# EAGLE design controller_rev3.1 (EAGLE 9.0.1)

## Sheet 1 of 3: Controller
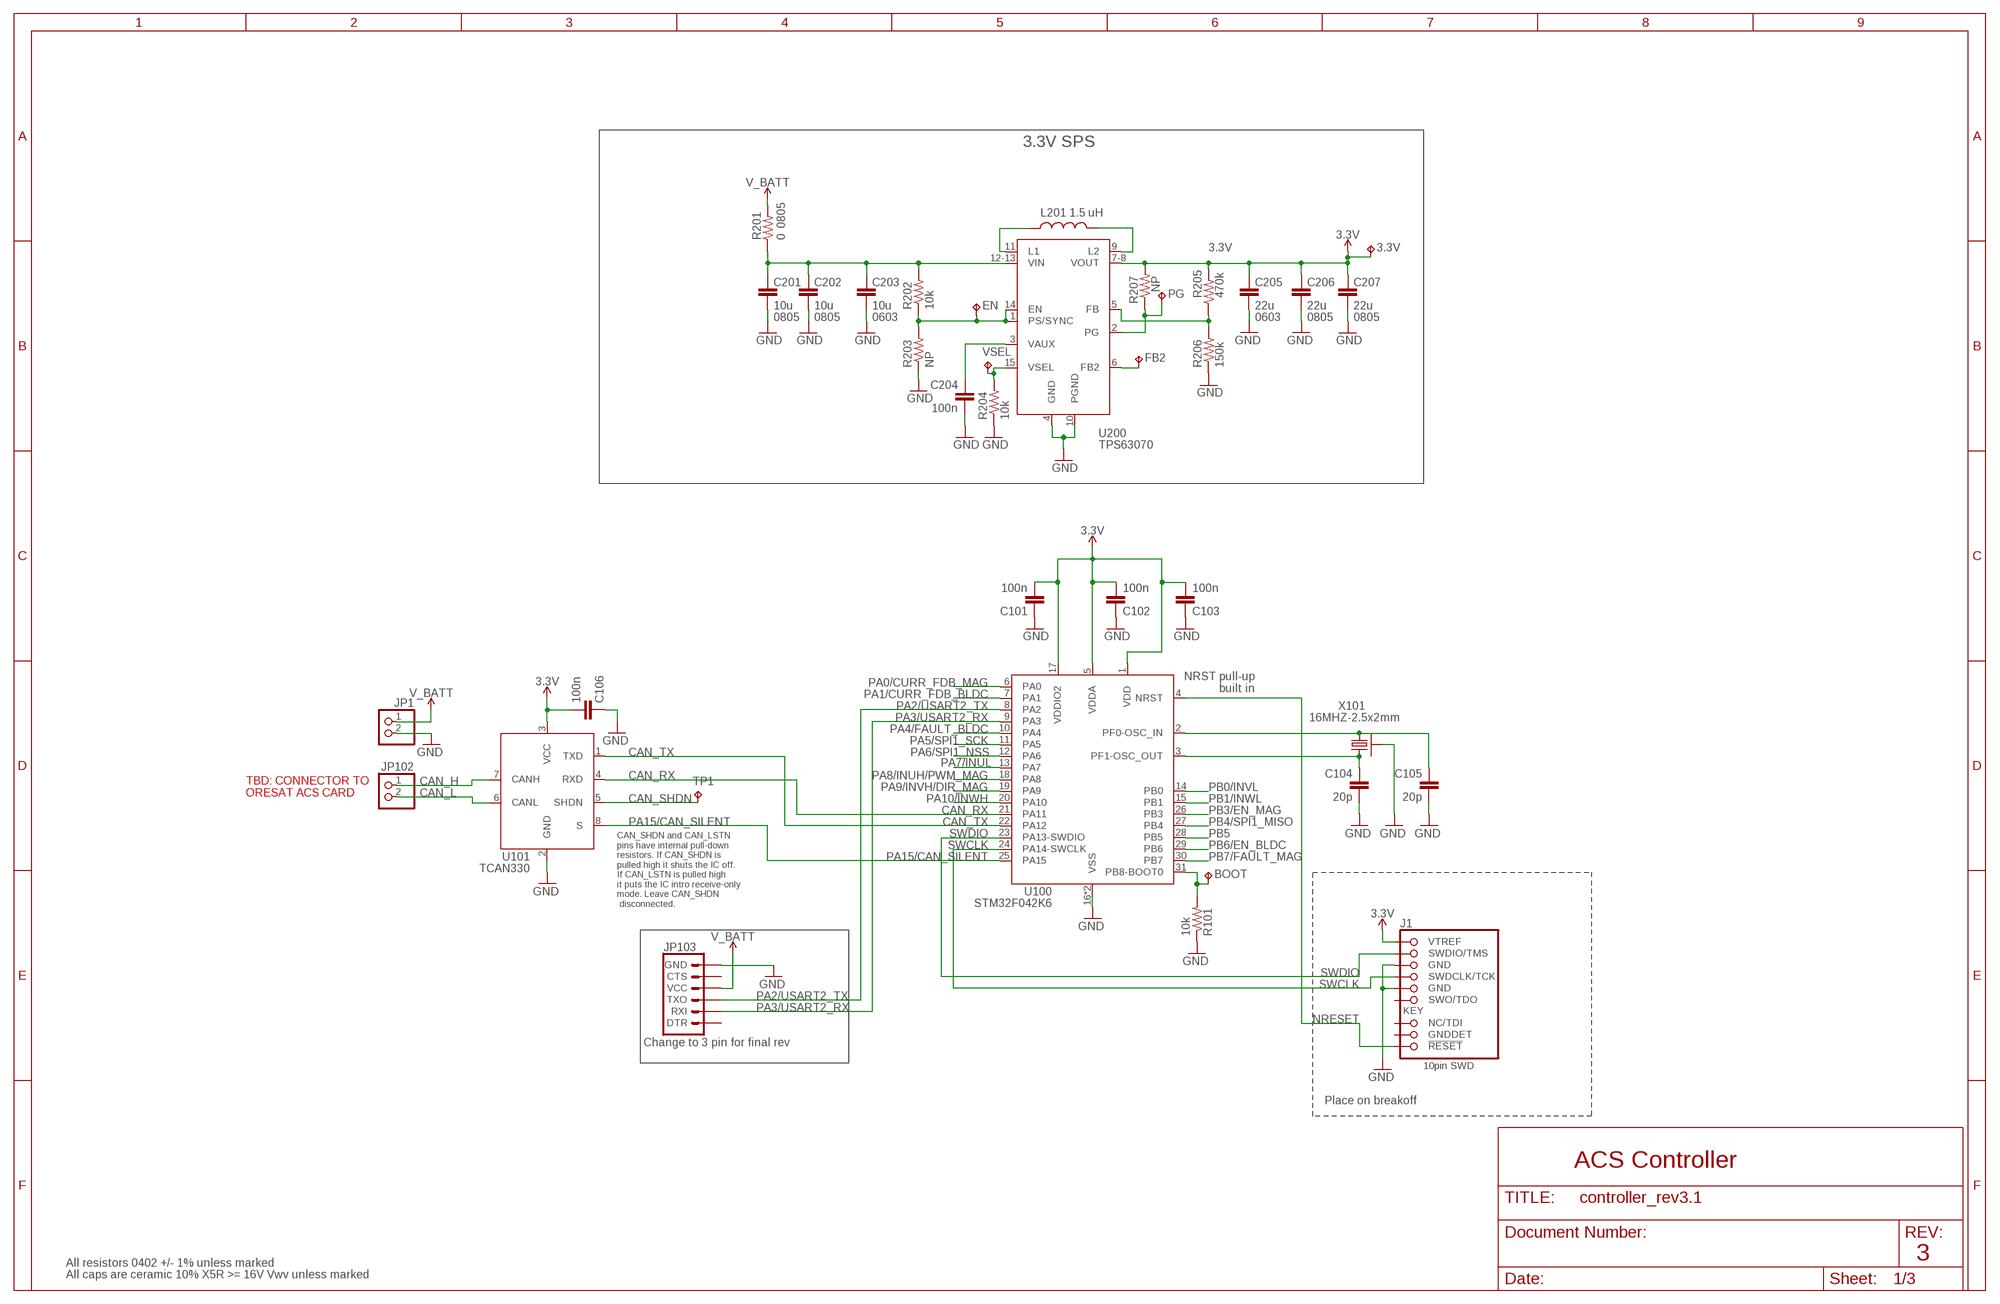
[diagram p0: schematic, sheet 1]

### Parts
3.3V  TPTP15SQ  [TP15SQ]
BOOT  TPTP15SQ  [TP15SQ]
C101  100n  C-EU0402-B-NOSILK  [.0402-B-NOSILK]
C102  100n  C-EU0402-B-NOSILK  [.0402-B-NOSILK]
C103  100n  C-EU0402-B-NOSILK  [.0402-B-NOSILK]
C104  20p  C-EU0402-B-NOSILK  [.0402-B-NOSILK]
C105  20p  C-EU0402-B-NOSILK  [.0402-B-NOSILK]
C106  100n  C-EU0402-B-NOSILK  [.0402-B-NOSILK]
C201  10u  C-EU0805-B-NOSILK  [.0805-B-NOSILK]
C202  10u  C-EU0805-B-NOSILK  [.0805-B-NOSILK]
C203  10u  C-EU0603-B-NOSILK  [.0603-B-NOSILK]
C204  100n  C-EU0402-B-NOSILK  [.0402-B-NOSILK]
C205  22u  C-EU0603-B-NOSILK  [.0603-B-NOSILK]
C206  22u  C-EU0805-B-NOSILK  [.0805-B-NOSILK]
C207  22u  C-EU0805-B-NOSILK  [.0805-B-NOSILK]
EN  TPTP15SQ  [TP15SQ]
FB2  TPTP15SQ  [TP15SQ]
J1  1.27MM-SWD-CONNECTOR  [1.27MM_2X5]
JP1  PINHD-1X2  [1X02]
JP102  PINHD-1X2  [1X02]
JP103  6_PIN_SERIAL_TARGETSILK  [6_PIN_SERIAL_TARGET_SIDE_W_SILK]
L201  1.5 uH  L-COILCRAFT-XFL4020  [L-COILCRAFT-XFL4020]
PG  TPTP15SQ  [TP15SQ]
R101  10k  R-US_0402-B-NOSILK  [.0402-B-NOSILK]
R201  0  R-US_0805-B-NOSILK  [.0805-B-NOSILK]
R202  10k  R-US_0402-B-NOSILK  [.0402-B-NOSILK]
R203  NP  R-US_0402-B-NOSILK  [.0402-B-NOSILK]
R204  10k  R-US_0402-B-NOSILK  [.0402-B-NOSILK]
R205  470k  R-US_0402-B-NOSILK  [.0402-B-NOSILK]
R206  150k  R-US_0402-B-NOSILK  [.0402-B-NOSILK]
R207  NP  R-US_0402-B-NOSILK  [.0402-B-NOSILK]
TP1  TPTP06R  [TP06R]
U100  STM32F042K6  [QFP32-7X7]
U101  TCAN330  [SOT23-8_TI-DCN]
U200  TPS63070  TPS63070X  [TPS63070X]
VSEL  TPTP15SQ  [TP15SQ]
X101  16MHZ-2.5x2mm  CRYSTAL-WITH-GND  [CRYSTAL_2.5X2]

### Nets
3.3V: 3.3V.TP C101.2 C102.2 C103.2 C106.2 C205.1 C206.1 C207.1 J1.VTREF R205.2 R207.2 U100.1(VDD) U100.5(VDDA) U100.17(VDDIO2) U101.3(VCC) U200.7-8(VOUT) ; also sheet 2,3
BOOT: BOOT.TP R101.2 U100.31(PB8-BOOT0)
CAN_H: JP102.1 U101.7(CANH)
CAN_L: JP102.2 U101.6(CANL)
CAN_RX: U100.21(PA11) U101.4(RXD)
CAN_SHDN: TP1.TP U101.5(SHDN)
CAN_TX: U100.22(PA12) U101.1(TXD)
CRYSTALIN: C105.1 U100.2(PF0-OSC_IN) X101.1
CRYSTALOUT: C104.1 U100.3(PF1-OSC_OUT) X101.3
GND: C101.1 C102.1 C103.1 C104.2 C105.2 C106.1 C201.2 C202.2 C203.2 C204.2 C205.2 C206.2 C207.2 J1.GND J1.GND@2(GND) JP1.2 JP103.P$6(GND) R101.1 R203.1 R204.1 R206.1 U100.16(VSS) U100.32(VSS) U101.2(GND) U200.4(GND) U200.10(PGND) X101.2(SHIELD) X101.4(SHIELD) ; also sheet 2,3
NRESET: J1.!RESET U100.4(NRST)
PA0/CURR_FDB_MAG: U100.6(PA0) ; also sheet 3
PA1/CURR_FDB_BLDC: U100.7(PA1) ; also sheet 2
PA2/USART2_TX: JP103.P$2(TXO) U100.8(PA2)
PA3/USART2_RX: JP103.P$3(RXI) U100.9(PA3)
PA4/FAULT_BLDC: U100.10(PA4) ; also sheet 2
PA5/SPI1_SCK: U100.11(PA5) ; also sheet 2
PA6/SPI1_NSS: U100.12(PA6) ; also sheet 2
PA7/INUL: U100.13(PA7) ; also sheet 2
PA8/INUH/PWM_MAG: U100.18(PA8) ; also sheet 2,3
PA9/INVH/DIR_MAG: U100.19(PA9) ; also sheet 2,3
PA10/INWH: U100.20(PA10) ; also sheet 2
PA15/CAN_SILENT: U100.25(PA15) U101.8(S)
PB0/INVL: U100.14(PB0) ; also sheet 2
PB1/INWL: U100.15(PB1) ; also sheet 2
PB3/EN_MAG: U100.26(PB3) ; also sheet 3
PB4/SPI1_MISO: U100.27(PB4) ; also sheet 2
PB5: U100.28(PB5)
PB6/EN_BLDC: U100.29(PB6) ; also sheet 2
PB7/FAULT_MAG: U100.30(PB7) ; also sheet 3
SWCLK: J1.SWDCLK(SWDCLK/TCK) U100.24(PA14-SWCLK)
SWDIO: J1.SWDIO(SWDIO/TMS) U100.23(PA13-SWDIO)
TPS-EN: EN.TP R202.1 R203.2 U200.1(PS/SYNC) U200.14(EN)
TPS-FB: R205.1 R206.2 U200.5(FB)
TPS-L1: L201.1 U200.11(L1)
TPS-L2: L201.2 U200.9(L2)
TPS-PG: PG.TP R207.1 U200.2(PG)
TPS-VAUX: C204.1 U200.3(VAUX)
TPS-VIN: C201.1 C202.1 C203.1 R201.1 R202.2 U200.12-13(VIN)
TSP-FB2: FB2.TP U200.6(FB2)
TSP-VSEL: R204.2 U200.15(VSEL) VSEL.TP
V_BATT: JP1.1 JP103.P$4(VCC) R201.2 ; also sheet 2,3
Unconnected: J1.GNDDET J1.NC(NC/TDI) J1.SWO(SWO/TDO) JP103.P$1(DTR) JP103.P$5(CTS)

### Notes on the sheet
- 3.3V SPS
- 0805
- 0805 | 0805 | 0603 | 0603 | 0805 | 0805
- NRST pull-up
  built in
- TBD: CONNECTOR TO 
  ORESAT ACS CARD
- CAN_SHDN and CAN_LSTN
  pins have internal pull-down
  resistors. If CAN_SHDN is 
  pulled high it shuts the IC off.
  If CAN_LSTN is pulled high
  it puts the IC intro receive-only
  mode. Leave CAN_SHDN
   disconnected.
- Change to 3 pin for final rev
- Place on breakoff
- ACS Controller
- 3
- All resistors 0402 +/- 1% unless marked
- All caps are ceramic 10% X5R >= 16V Vwv unless marked

## Sheet 2 of 3: Reaction Wheel
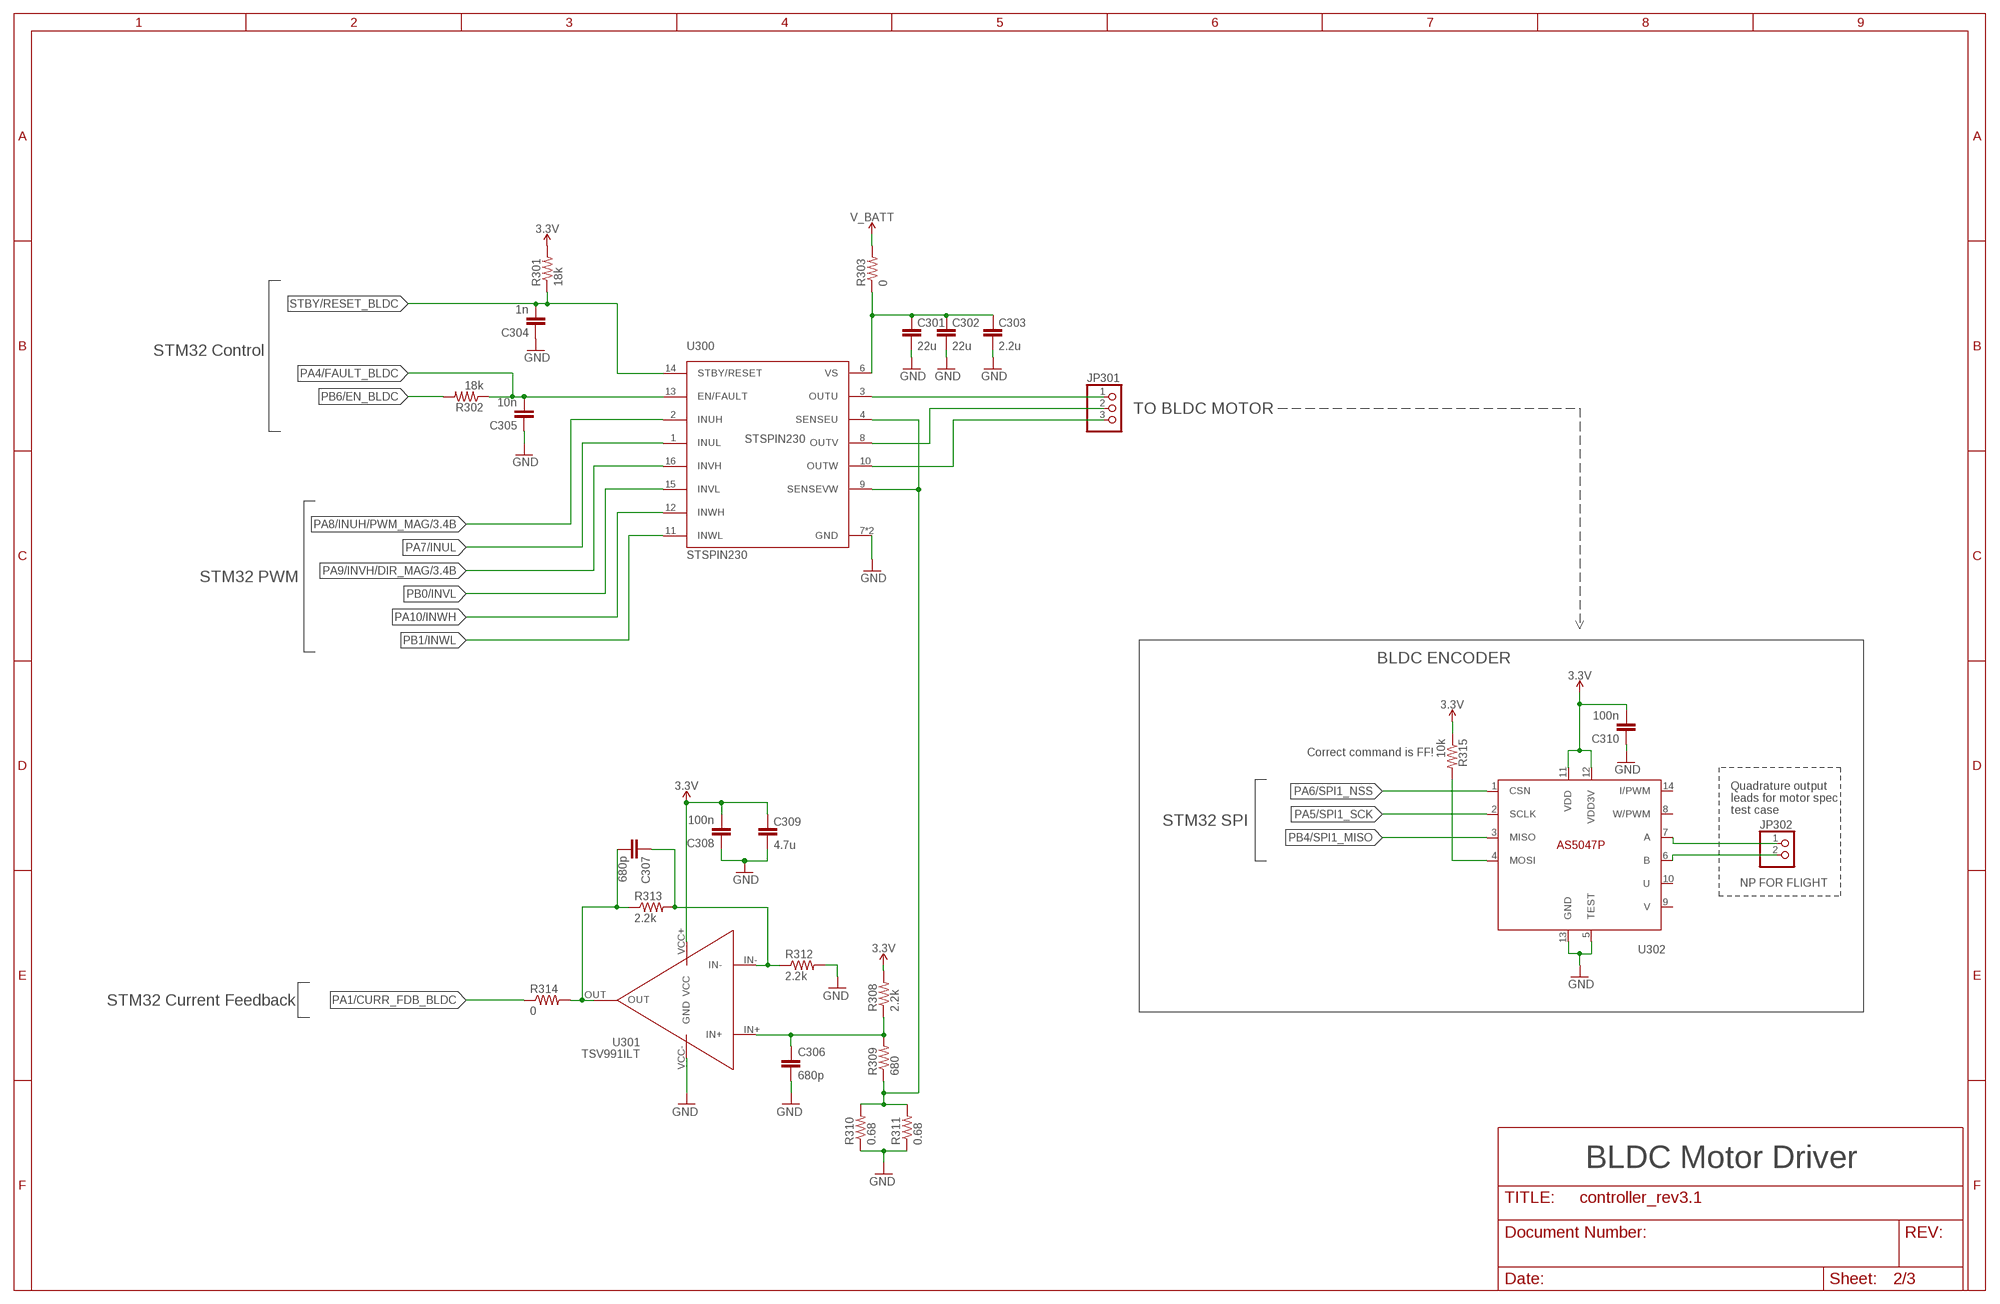
[diagram p1: schematic, sheet 2]

### Parts
C301  22u  C-EU0603-B-NOSILK  [.0603-B-NOSILK]
C302  22u  C-EU0603-B-NOSILK  [.0603-B-NOSILK]
C303  2.2u  C-EU0603-B-NOSILK  [.0603-B-NOSILK]
C304  1n  C-EU0402-B-NOSILK  [.0402-B-NOSILK]
C305  10n  C-EU0402-B-NOSILK  [.0402-B-NOSILK]
C306  680p  C-EU0402-B-NOSILK  [.0402-B-NOSILK]
C307  680p  C-EU0402-B-NOSILK  [.0402-B-NOSILK]
C308  100n  C-EU0402-B-NOSILK  [.0402-B-NOSILK]
C309  4.7u  C-EU0603-B-NOSILK  [.0603-B-NOSILK]
C310  100n  C-EU0402-B-NOSILK  [.0402-B-NOSILK]
JP301  PINHD-1X03_2.00  [1X03M]
JP302  PINHD-1X2  [1X02]
R301  18k  R-US_0402-B-NOSILK  [.0402-B-NOSILK]
R302  18k  R-US_0402-B-NOSILK  [.0402-B-NOSILK]
R303  0  R-US_0805-B-NOSILK  [.0805-B-NOSILK]
R308  2.2k  R-US_0402-B-NOSILK  [.0402-B-NOSILK]
R309  680  R-US_0402-B-NOSILK  [.0402-B-NOSILK]
R310  0.68  R-US_0805-B-NOSILK  [.0805-B-NOSILK]
R311  0.68  R-US_0805-B-NOSILK  [.0805-B-NOSILK]
R312  2.2k  R-US_0402-B-NOSILK  [.0402-B-NOSILK]
R313  2.2k  R-US_0402-B-NOSILK  [.0402-B-NOSILK]
R314  0  R-US_0402-B-NOSILK  [.0402-B-NOSILK]
R315  10k  R-US_0402-B-NOSILK  [.0402-B-NOSILK]
U300  STSPIN230  [VFQFPN]
U301  TSV991ILT  [SOT23-5]
U302  AS5047P  [TSSOP14]

### Nets
3.3V: C308.2 C309.1 C310.2 R301.2 R308.2 R315.1 U301.VCC+(VCC) U302.11(VDD) U302.12(VDD3V) ; also sheet 1,3
AS5047_MOSI: R315.2 U302.4(MOSI)
BLDC-I-IN+: C306.1 R308.1 R309.2 U301.IN+
BLDC-I-IN-: C307.1 R312.1 R313.2 U301.IN-
BLDC-I-OUT: C307.2 R313.1 R314.2 U301.OUT
GND: C301.2 C302.2 C303.2 C304.1 C305.1 C306.2 C308.1 C309.2 C310.1 R310.1 R311.1 R312.2 U300.7(GND) U300.EPAD(GND) U301.VCC-(GND) U302.5(TEST) U302.13(GND) ; also sheet 1,3
N$7: C301.1 C302.1 C303.1 R303.1 U300.6(VS)
PA1/CURR_FDB_BLDC: R314.1 ; also sheet 1
PA4/FAULT_BLDC: C305.2 R302.1 U300.13(EN/FAULT) ; also sheet 1
PA5/SPI1_SCK: U302.2(SCLK) ; also sheet 1
PA6/SPI1_NSS: U302.1(CSN) ; also sheet 1
PA7/INUL: U300.1(INUL) ; also sheet 1
PA8/INUH/PWM_MAG: U300.2(INUH) ; also sheet 1,3
PA9/INVH/DIR_MAG: U300.16(INVH) ; also sheet 1,3
PA10/INWH: U300.12(INWH) ; also sheet 1
PB0/INVL: U300.15(INVL) ; also sheet 1
PB1/INWL: U300.11(INWL) ; also sheet 1
PB4/SPI1_MISO: U302.3(MISO) ; also sheet 1
PB6/EN_BLDC: R302.2 ; also sheet 1
QUAD_A: JP302.1 U302.7(A)
QUAD_B: JP302.2 U302.6(B)
SENSE_BLDC: R309.1 R310.2 R311.2 U300.4(SENSEU) U300.9(SENSEVW)
STBY/RESET_BLDC: C304.2 R301.1 U300.14(STBY/RESET)
U: JP301.1 U300.3(OUTU)
V: JP301.2 U300.8(OUTV)
V_BATT: R303.2 ; also sheet 1,3
W: JP301.3 U300.10(OUTW)
Unconnected: U302.8(W/PWM) U302.9(V) U302.10(U) U302.14(I/PWM)

### Notes on the sheet
- STM32 Control
- TO BLDC MOTOR
- STM32 PWM
- BLDC ENCODER
- Correct command is FF!
- Quadrature output
  leads for motor spec
  test case
- STM32 SPI
- NP FOR FLIGHT
- STM32 Current Feedback
- BLDC Motor Driver

## Sheet 3 of 3: Magnetorquer
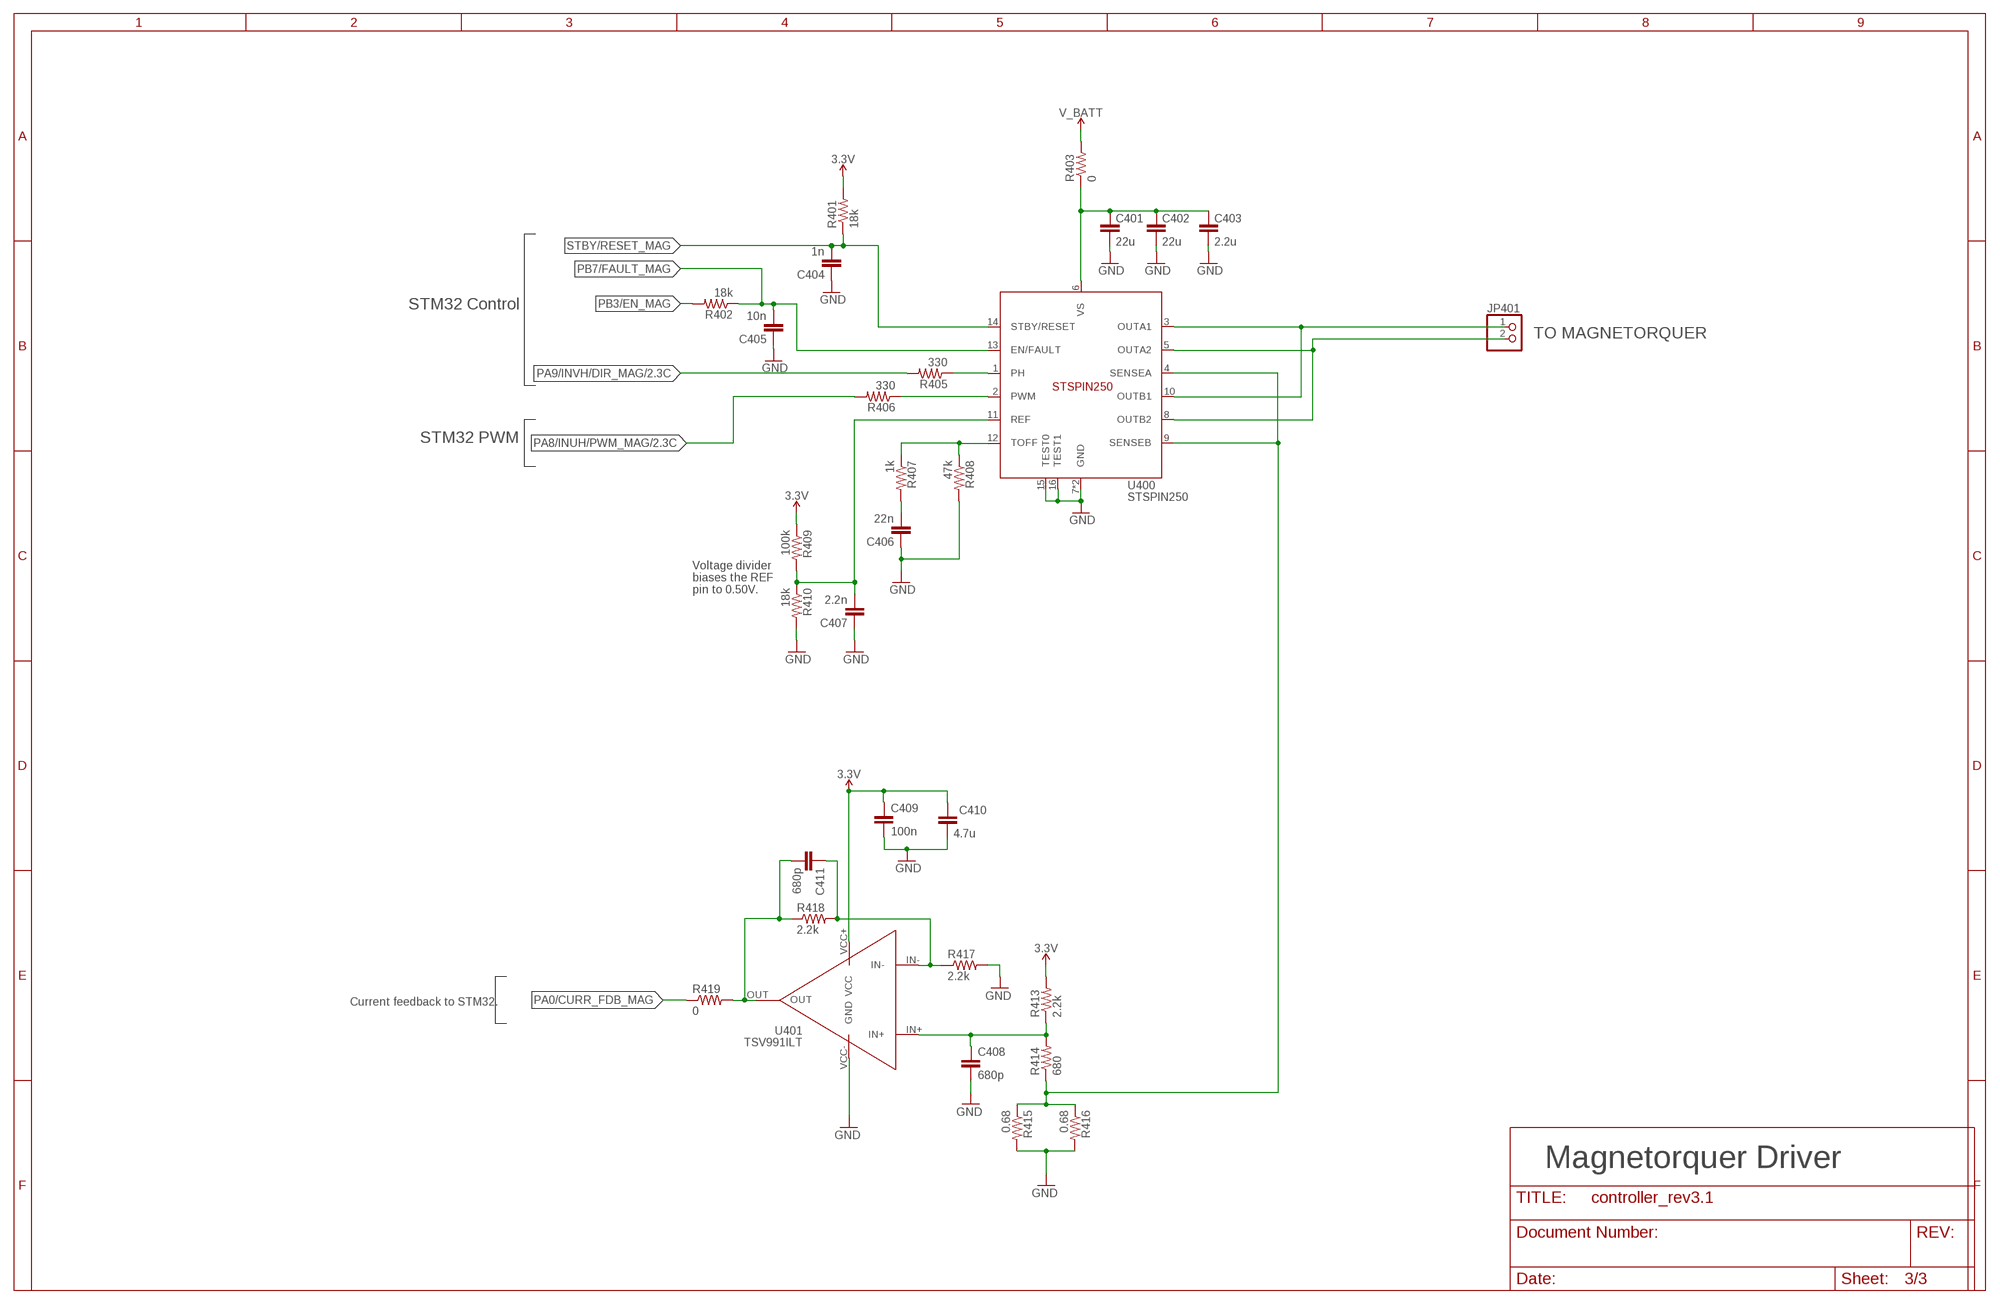
[diagram p2: schematic, sheet 3]

### Parts
C401  22u  C-EU0603-B-NOSILK  [.0603-B-NOSILK]
C402  22u  C-EU0603-B-NOSILK  [.0603-B-NOSILK]
C403  2.2u  C-EU0603-B-NOSILK  [.0603-B-NOSILK]
C404  1n  C-EU0402-B-NOSILK  [.0402-B-NOSILK]
C405  10n  C-EU0402-B-NOSILK  [.0402-B-NOSILK]
C406  22n  C-EU0402-B-NOSILK  [.0402-B-NOSILK]
C407  2.2n  C-EU0402-B-NOSILK  [.0402-B-NOSILK]
C408  680p  C-EU0402-B-NOSILK  [.0402-B-NOSILK]
C409  100n  C-EU0402-B-NOSILK  [.0402-B-NOSILK]
C410  4.7u  C-EU0603-B-NOSILK  [.0603-B-NOSILK]
C411  680p  C-EU0402-B-NOSILK  [.0402-B-NOSILK]
JP401  PINHD-1X2  [1X02]
R401  18k  R-US_0402-B-NOSILK  [.0402-B-NOSILK]
R402  18k  R-US_0402-B-NOSILK  [.0402-B-NOSILK]
R403  0  R-US_0805-B-NOSILK  [.0805-B-NOSILK]
R405  330  R-US_0402-B-NOSILK  [.0402-B-NOSILK]
R406  330  R-US_0402-B-NOSILK  [.0402-B-NOSILK]
R407  1k  R-US_0402-B-NOSILK  [.0402-B-NOSILK]
R408  47k  R-US_0402-B-NOSILK  [.0402-B-NOSILK]
R409  100k  R-US_0402-B-NOSILK  [.0402-B-NOSILK]
R410  18k  R-US_0402-B-NOSILK  [.0402-B-NOSILK]
R413  2.2k  R-US_0402-B-NOSILK  [.0402-B-NOSILK]
R414  680  R-US_0402-B-NOSILK  [.0402-B-NOSILK]
R415  0.68  R-US_0805-B-NOSILK  [.0805-B-NOSILK]
R416  0.68  R-US_0805-B-NOSILK  [.0805-B-NOSILK]
R417  2.2k  R-US_0402-B-NOSILK  [.0402-B-NOSILK]
R418  2.2k  R-US_0402-B-NOSILK  [.0402-B-NOSILK]
R419  0  R-US_0402-B-NOSILK  [.0402-B-NOSILK]
U400  STSPIN250  [VFQPN]
U401  TSV991ILT  [SOT23-5]

### Nets
3.3V: C409.1 C410.1 R401.2 R409.1 R413.2 U401.VCC+(VCC) ; also sheet 1,2
250_REF: C407.2 R409.2 R410.1 U400.11(REF)
250_TOFF: R407.1 R408.1 U400.12(TOFF)
GND: C401.2 C402.2 C403.2 C404.1 C405.1 C406.1 C407.1 C408.2 C409.2 C410.2 R408.2 R410.2 R415.2 R416.2 R417.2 U400.7(GND) U400.15(TEST0) U400.16(TEST1) U400.EPAD(GND) U401.VCC-(GND) ; also sheet 1,2
MAG-I-IN+: C408.1 R413.1 R414.2 U401.IN+
MAG-I-IN-: C411.1 R417.1 R418.2 U401.IN-
MAG-I-OUT: C411.2 R418.1 R419.2 U401.OUT
N$2: C406.2 R407.2
N$3: R406.1 U400.2(PWM)
N$5: R405.1 U400.1(PH)
N$8: C401.1 C402.1 C403.1 R403.1 U400.6(VS)
OUT1: JP401.1 U400.3(OUTA1) U400.10(OUTB1)
OUT2: JP401.2 U400.5(OUTA2) U400.8(OUTB2)
PA0/CURR_FDB_MAG: R419.1 ; also sheet 1
PA8/INUH/PWM_MAG: R406.2 ; also sheet 1,2
PA9/INVH/DIR_MAG: R405.2 ; also sheet 1,2
PB3/EN_MAG: R402.2 ; also sheet 1
PB7/FAULT_MAG: C405.2 R402.1 U400.13(EN/FAULT) ; also sheet 1
SENSE_MAG: R414.1 R415.1 R416.1 U400.4(SENSEA) U400.9(SENSEB)
STBY/RESET_MAG: C404.2 R401.1 U400.14(STBY/RESET)
V_BATT: R403.2 ; also sheet 1,2

### Notes on the sheet
- STM32 Control
- TO MAGNETORQUER
- STM32 PWM
- Voltage divider
  biases the REF
  pin to 0.50V.
- Current feedback to STM32.
- Magnetorquer Driver

## Library data of the parts
3.3V BOOT EN FB2 PG TP1 VSEL = testpad:TP: Test pad
C101-C103 C106 C204 C304-C308 C310 C404-C409 C411 = rcl_custom:C-EU: CAPACITOR, European symbol; DIS: Digi-Key; DPN: 1276-1001-1-ND; MFR: Samsung; MPN: CL05B104KO5NNNC
C104 C105 = rcl_custom:C-EU: CAPACITOR, European symbol; DIS: Digi-Key; DPN: 1276-6601-1-ND; MFR: Samsung; MPN: CL05C200JB51PNC
C201 C202 C206 C207 = oresat-rcl:C-EU: CAPACITOR, European symbol
C203 C205 C301-C303 C309 C401-C403 C410 = oresat-rcl:C-EU: CAPACITOR, European symbol; DIS: Digi-Key; DPN: 1276-1001-1-ND; MFR: Samsung; MPN: CL05B104KO5NNNC
J1 = J-CNC-3220-10-0100-00-ARM-SWD-port:1.27MM-SWD-CONNECTOR: ARM SWD Programming Header. Example part is the CNC 3220-10-0100-00
JP1 JP102 JP302 JP401 = pinhead:PINHD-1X2: PIN HEADER
JP103 = SparkFun-Connectors:6_PIN_SERIAL_TARGET: 6-pin header connection for use with the "FTDI BASIC" pinout - TARGET SIDE. Also known as "Arduino Serial Program Header". It is used to mate with our FTDI Basic serial programmers using the Arduino IDE. Note, this device has "TARGET" in the name. It is intended to be used on a design that contains a target micro-controller that you wish to program. The "sister" device, named "CABLE" is inteneded to be used on a design that usually lives on the end of your USB cable and prvides the converter chip (FTDI232 or FTDI231x) to commnicate serial RX/TX. You can populate with some of these: Break Away Headers - Straight <https://www.sparkfun.com/products/116> (PRT-00116) For reference (or to suit your programming needs) check out these designs: SparkFun FTDI Basic Breakout - 5V <https://www.sparkfun.com/products/9716> (DEV-09716) SparkFun FTDI Basic Breakout - 3.3V <https://www.sparkfun.com/products/9873> (DEV-09873) SparkFun FTDI SmartBasic <https://www.sparkfun.com/products/12935> (DEV-12935) SparkFun Beefy 3 - FTDI Basic Breakout <https://www.sparkfun.com/products/13746> (DEV-13746)
JP301 = pinhead-2:PINHD-1X03: PIN HEADER
L201 = L-Coilcraft-XFL4020:L-COILCRAFT-XFL4020; DIS: Mouser; DPN: 994-XFL4020-152MEB; MFR: Coilcraft; MPN: XFL4020-152ME
R101 R202-R207 R301 R302 R308 R309 R312-R315 R401 R402 R405-R410 R413 R414 R417-R419 = rcl_custom:R-US_: RESISTOR, American symbol; DIS: Digi-Key; DPN: 1276-4275-1-ND; MFR: Samsung; MPN: RC1005F6653CS
R201 = rcl_custom:R-US_: RESISTOR, American symbol; DIS: Digi-Key; DPN: RHM0.0ARCT-ND; MFR: Rohm; MPN: MCR10EZPJ000
R303 R310 R311 R403 R415 R416 = oresat-rcl:R-US_: RESISTOR, American symbol
U100 = STM32F042K:STM32F042K6; DIS: Digi-Key; DPN: STM32F042K6T7-ND; MFR: STMicroelectronics; MPN: STM32F042K6T7
U101 = TCAN330:TCAN330; DIS: Digi-Key; DPN: 296-44211-1-ND; MFR: Texas Instruments; MPN: TCAN330GDCNT
U200 = ic-pwr-tps63070x:TPS63070X: TPS63070 2-V to 16-V Buck-Boost Converter With 3.6-A Switch Current
U300 = U-ST-STSPIN230-BLDC-controller:STSPIN230
U301 U401 = TSV991ILT:TSV991ILT
U302 = U-AMS-AS5047P-encoder:AS5047P
U400 = U-ST-STSPIN250-Brushed-DC-controller:STSPIN250
X101 = low-gain-radio:CRYSTAL-WITH-GND; DIS: Digi-Key; DPN: XC2181CT-ND; MFR: ECS Inc.; MPN: ECS-160-10-36Q-ES-TR

## Board
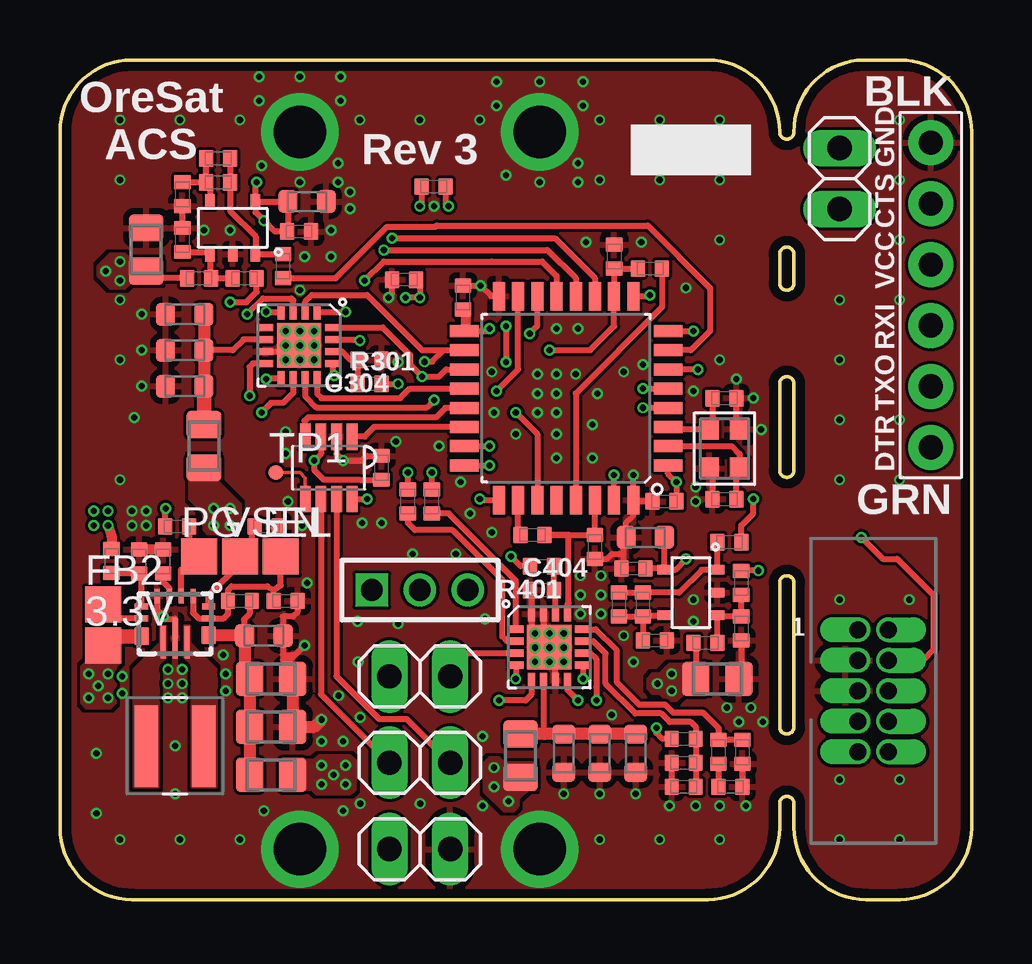
[diagram p3: board, top side]
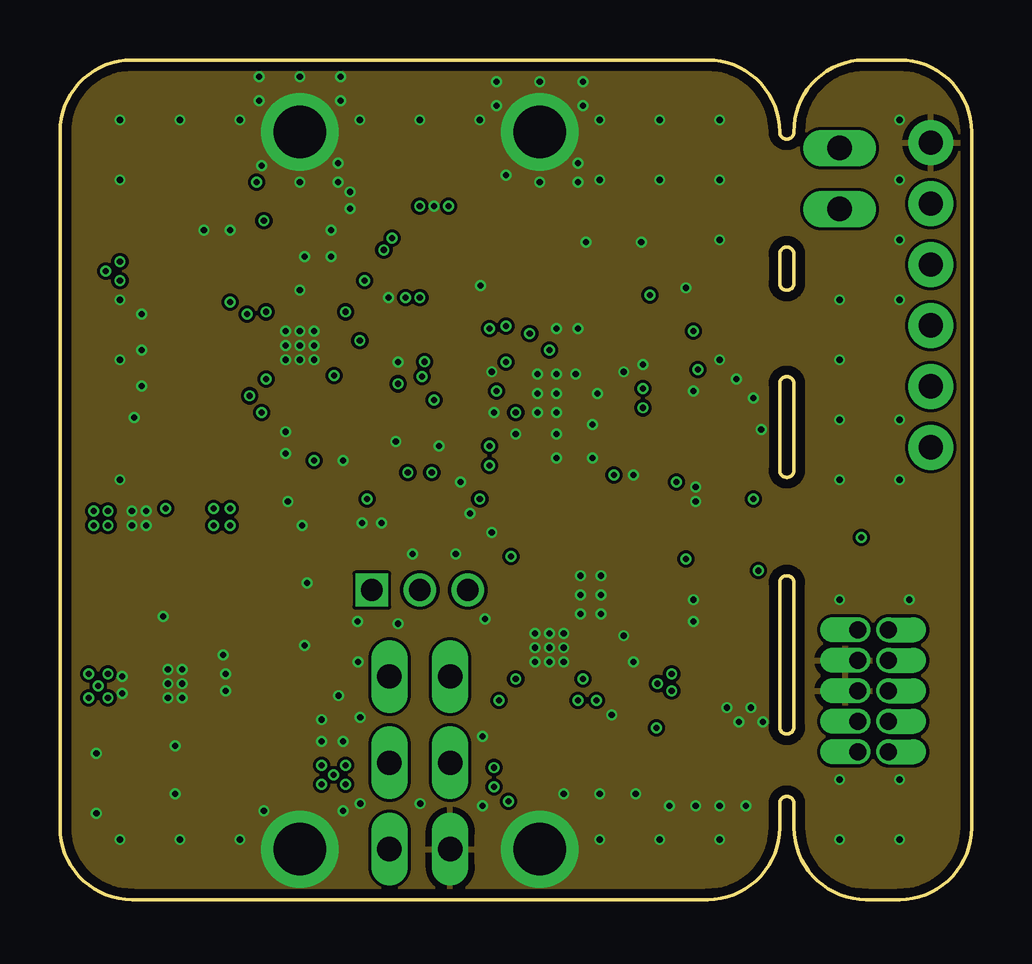
[diagram p4: board, inner layer Route2]
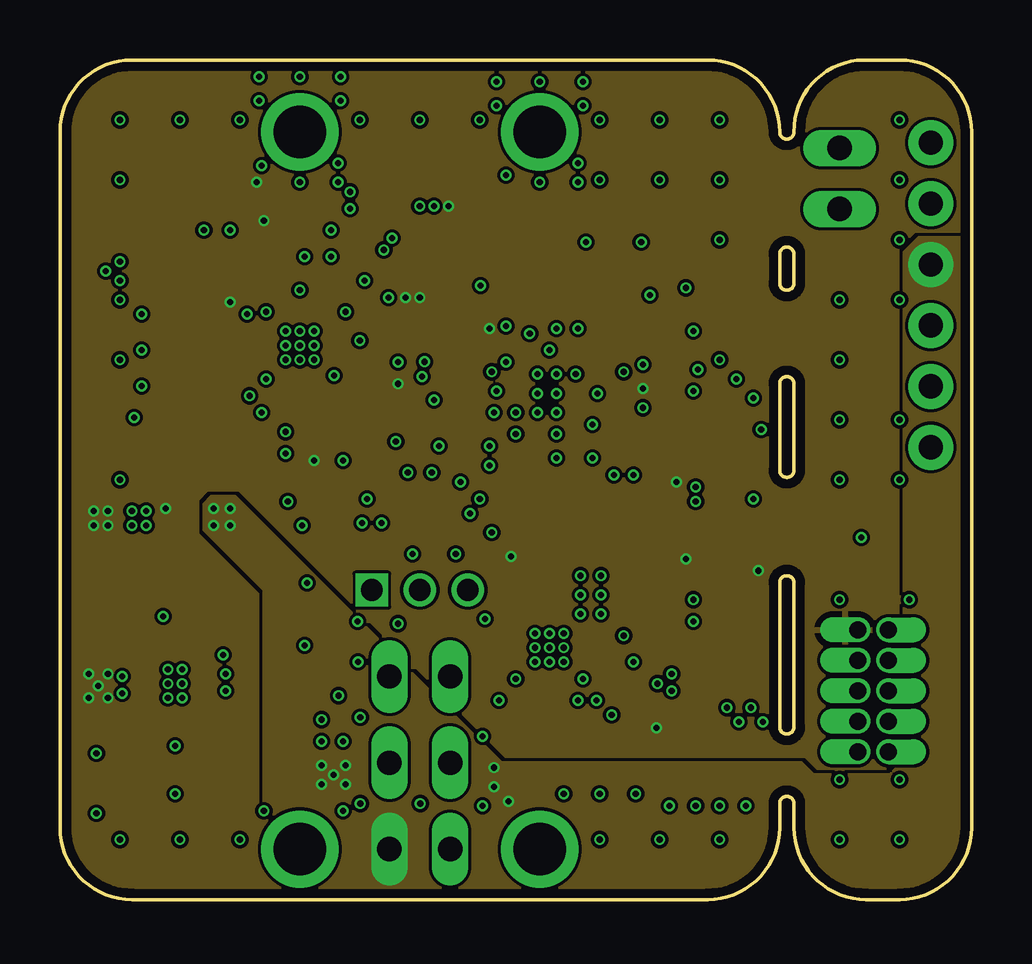
[diagram p5: board, inner layer Route15]
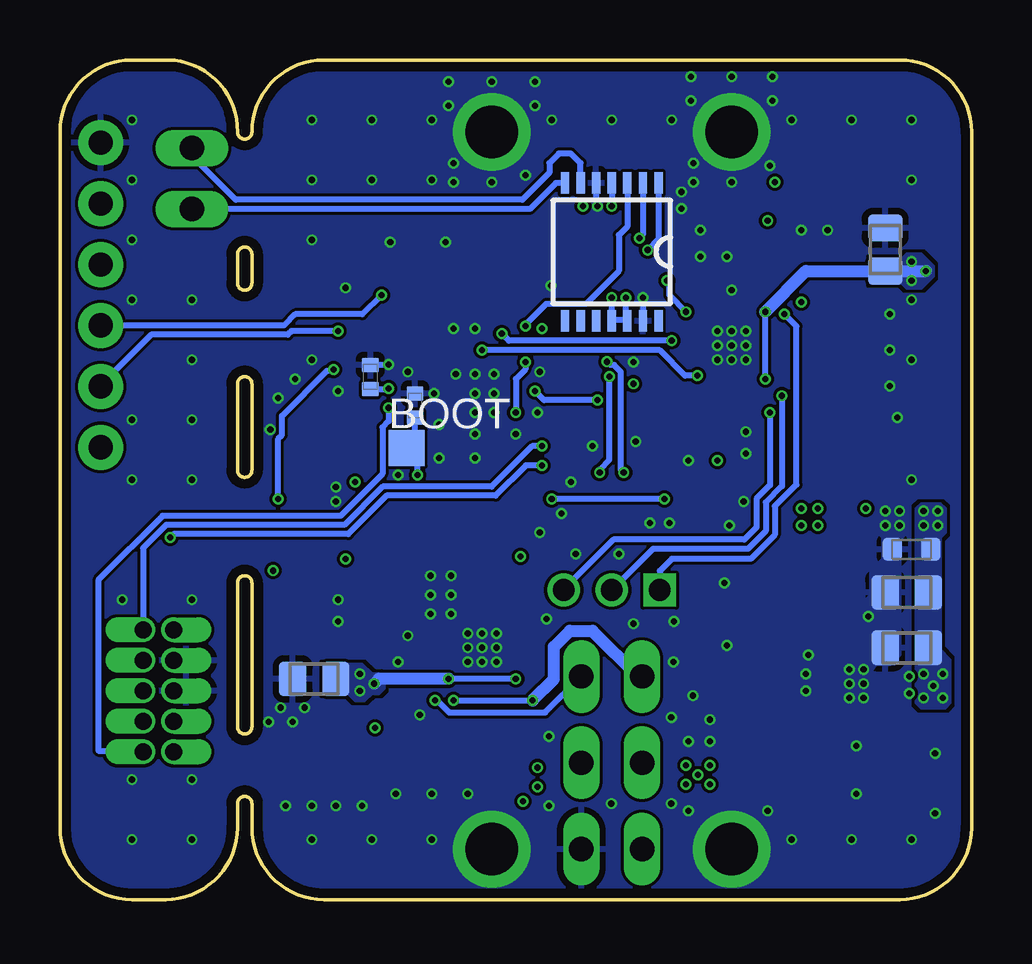
[diagram p6: board, bottom side, seen from below]

Size 38 x 35 mm. Coordinates in mm from the lower left corner, seen from the top.
Outline: 0,3 arc90 3,0 27,0 arc90 30,3 30,4 arc-90 30.3,4.3 arc-90 30.6,4 30.6,3 arc90 33.6,0 35,0 arc90 38,3 38,32 arc90 35,35 33.5,35 arc90 30.6,32 arc-90 30.3,31.7 arc-90 30,32 arc90 27,35 3,35 arc90 0,32 0,3
Outline: 30.3,6.9 arc-90 30,7.2 30,13.2 arc-90 30.3,13.5 arc-90 30.6,13.2 30.6,7.2 arc-90 30.3,6.9
Outline: 30.3,17.6 arc-90 30,17.9 30,21.5 arc-90 30.3,21.8 arc-90 30.6,21.5 30.6,17.9 arc-90 30.3,17.6
Outline: 30.3,25.4 arc-90 30,25.7 30,26.9 arc-90 30.3,27.2 arc-90 30.6,26.9 30.6,25.7 arc-90 30.3,25.4
Copper layers (1*2*15*16): Top 0.035559375mm / dielectric 0.17018125mm / Route2 0.01778125mm / dielectric 47mil / Route15 0.01778125mm / dielectric 0.17018125mm / Bottom 0.035559375mm
Design rules "oshpark-4layer-tented": minimum track width 5mil, minimum drill 10mil, track to track 5mil, track to pad 5mil, pad to pad 5mil, via to via 5mil, smd to smd 5mil, copper to edge 15mil, drill to drill 6mil, minimum pad ring 4mil, minimum via ring 4mil, stop-mask expansion 2.5mil, vias tented up to drill 20mil, thermal gap 10mil

### Footprints (pad centres in the part's own frame; a part is rotated, then mirrored left to right if it is on the bottom)
TP15SQ = smd 1.5 x 1.5: TP 0,0
.0402-B-NOSILK = smd 0.6 x 0.7: 1 -0.5,0; 2 0.5,0
.0805-B-NOSILK = smd 1.15 x 1.45: 1 -0.9,0; 2 0.9,0
.0603-B-NOSILK = smd 0.8 x 0.95: 1 -0.8,0; 2 0.8,0
1.27MM_2X5 = drill 0.7 pad 1.016 offset: !RESET 0.635,-2.54; GND -0.635,1.27; GND@2 -0.635,0; GNDDET -0.635,-2.54; KEY -0.635,-1.27; NC 0.635,-1.27; SWDCLK 0.635,1.27; SWDIO 0.635,2.54; SWO 0.635,0; VTREF -0.635,2.54
1X02 = drill 1.016 long: 1 -1.27,0; 2 1.27,0
6_PIN_SERIAL_TARGET_SIDE_W_SILK = drill 1.016 pad 1.88: P$1 -6.35,0; P$2 -3.81,0; P$3 -1.27,0; P$4 1.27,0; P$5 3.81,0; P$6 6.35,0
1X03M = drill 0.914 square: 1 -2,0 | drill 0.914: 2 0,0; 3 2,0
L-COILCRAFT-XFL4020 = smd 0.98 x 3.4: 1 -1.2,0; 2 1.2,0
TP06R = smd 0.6 x 0.6: TP 0,0
QFP32-7X7 = smd 1.2 x 0.5: 1 -4.25,2.8; 2 -4.25,2; 3 -4.25,1.2; 4 -4.25,0.4; 5 -4.25,-0.4; 6 -4.25,-1.2; 7 -4.25,-2; 8 -4.25,-2.8; 17 4.25,-2.8; 18 4.25,-2; 19 4.25,-1.2; 20 4.25,-0.4; 21 4.25,0.4; 22 4.25,1.2; 23 4.25,2; 24 4.25,2.8 | smd 0.5 x 1.2: 9 -2.8,-4.25; 10 -2,-4.25; 11 -1.2,-4.25; 12 -0.4,-4.25; 13 0.4,-4.25; 14 1.2,-4.25; 15 2,-4.25; 16 2.8,-4.25; 25 2.8,4.25; 26 2,4.25; 27 1.2,4.25; 28 0.4,4.25; 29 -0.4,4.25; 30 -1.2,4.25; 31 -2,4.25; 32 -2.8,4.25
SOT23-8_TI-DCN = smd 0.45 x 1.1: 1 -0.975,-1.3; 2 -0.325,-1.3; 3 0.325,-1.3; 4 0.975,-1.3; 5 0.975,1.3; 6 0.325,1.3; 7 -0.325,1.3; 8 -0.975,1.3
TPS63070X = smd 0.6 x 0.25: 1 -1.15,0.75; 2 -1.15,0.25; 3 -1.15,-0.25; 4 -1.15,-0.75 | smd 0.25 x 0.6: 5 -0.725,-1.4; 6 -0.225,-1.4; 14 -0.225,1.4; 15 -0.725,1.4 | smd 0.75 x 0.6: 7-8 0.525,-1.4; 12-13 0.475,1.4 | smd 1.35 x 0.25: 9 0.775,-0.5; 11 0.775,0.5 | smd 1.7 x 0.25: 10 0.6,0
VFQFPN = smd 0.63 x 0.3: 1 -1.39,0.75; 2 -1.39,0.25; 3 -1.39,-0.25; 4 -1.39,-0.75; 9 1.39,-0.75; 10 1.39,-0.25; 11 1.39,0.25; 12 1.39,0.75 | smd 0.3 x 0.63: 5 -0.75,-1.39; 6 -0.25,-1.39; 7 0.25,-1.39; 8 0.75,-1.39; 13 0.75,1.39; 14 0.25,1.39; 15 -0.25,1.39; 16 -0.75,1.39 | smd 1.85 x 1.85: EPAD 0,0
SOT23-5 = smd 0.4 x 0.6: IN+ 0.95,1.1; IN- 0.95,-1.1; OUT -0.95,1.1; VCC+ -0.95,-1.1; VCC- 0,1.1
TSSOP14 = smd 0.9 x 0.35: 1 -2.875,1.95; 2 -2.875,1.3; 3 -2.875,0.65; 4 -2.875,0; 5 -2.875,-0.65; 6 -2.875,-1.3; 7 -2.875,-1.95; 8 2.875,-1.95; 9 2.875,-1.3; 10 2.875,-0.65; 11 2.875,0; 12 2.875,0.65; 13 2.875,1.3; 14 2.875,1.95
VFQPN = smd 0.63 x 0.3: 1 -1.39,0.75; 2 -1.39,0.25; 3 -1.39,-0.25; 4 -1.39,-0.75; 9 1.39,-0.75; 10 1.39,-0.25; 11 1.39,0.25; 12 1.39,0.75 | smd 0.3 x 0.63: 5 -0.75,-1.39; 6 -0.25,-1.39; 7 0.25,-1.39; 8 0.75,-1.39; 13 0.75,1.39; 14 0.25,1.39; 15 -0.25,1.39; 16 -0.75,1.39 | smd 1.85 x 1.85: EPAD 0,0
CRYSTAL_2.5X2 = smd 0.9 x 0.8: 1 -0.825,-0.625; 2 0.825,-0.625; 3 0.825,0.625; 4 -0.825,0.625

### Placement (x,y rotation side)
3.3V  1.8,10.6 0 top
BOOT  23.55,18.83 0 bottom
C101  16.8,25.1 270 top
C102  25.06,21.79 270 bottom
C103  25.2,16.6 0 top
C104  27.7,20.9 0 top
C105  27.7,16.69 180 top
C106  13.4,18 270 top
C201  8.8,7.2 0 top
C202  8.8,9.2 0 top
C203  8.5,11 0 top
C204  4.3,14.1 90 top
C205  2.5,14.6 180 bottom
C206  2.7,10.5 180 bottom
C207  2.7,12.8 180 bottom
C301  5.2,22.9 180 top
C302  5.2,24.4 180 top
C303  5.2,21.4 180 top
C304  12.9,22.5 180 top
C305  23.1,26.8 270 top
C306  5.1,27.5 90 top
C307  6.6,30.9 0 top
C308  9.97,27.85 180 top
C309  10.3,29.1 0 top
C310  14.35,25.84 0 top
C401  21,6.1 270 top
C402  22.5,6.1 270 top
C403  24,6.1 270 top
C404  20.1,12.9 0 top
C405  22.3,14.7 90 top
C406  27.95,4.7 180 top
C407  26,4.7 0 top
C408  28.4,11.3 270 top
C409  23.9,13.8 180 top
C410  24.4,15.1 180 top
C411  24.3,12.3 90 top
EN  9.2,14.3 0 top
FB2  1.8,12.3 0 top
J1  33.9,8.7 0 top
JP1  15,2.1 0 top
JP102  15,5.7 180 top
JP103  36.3,25.2 90 top
JP301  15,12.9 0 top
JP302  32.5,30.06 90 top
JP401  15,9.3 180 top
L201  4.8,6.4 180 top
PG  5.8,14.3 0 top
R101  23.2,20.6 270 bottom
R201  8.8,5.2 0 top
R202  7.5,12.45 0 top
R203  9.4,12.45 180 top
R204  8.61,15.55 180 top
R205  2.15,14.11 90 top
R206  3.3,14.1 270 top
R207  4.89,15.55 180 top
R301  12.9,21.5 0 top
R302  24.6,26.3 0 top
R303  6,18.9 270 top
R308  7.7,25.9 0 top
R309  5.8,25.9 0 top
R310  3.6,27.1 270 bottom
R311  3.6,27.1 270 top
R312  5.1,29.4 270 top
R313  6.6,29.9 180 top
R314  9.3,26.4 90 top
R315  15.58,29.72 180 top
R401  20.1,13.9 180 top
R402  19.7,15.2 180 top
R403  19.2,6 270 top
R405  15.5,16.6 90 top
R406  14.5,16.6 90 top
R407  27.45,6.15 270 top
R408  28.45,6.15 270 top
R409  26,6.7 0 top
R410  26,5.7 180 top
R413  28.4,13.2 90 top
R414  26.9,10.7 0 top
R415  27.4,9.2 180 bottom
R416  27.4,9.2 0 top
R417  24.8,10.8 0 top
R418  23.3,12.3 270 top
R419  27.9,14.9 180 top
TP1  9,17.8 0 top
U100  21.1,20.9 180 top
U101  11.2,18 180 top
U200  4.8,11.5 270 top
U300  9.97,23.1 270 top
U301  7.2,28 180 top
U302  15,27 270 bottom
U400  20.4,10.52 0 top
U401  26.3,12.8 270 top
VSEL  7.5,14.3 0 top
X101  27.7,18.8 90 top

### Tracks (layer width: path | path; a pad name or v marks a point on that pad's centre or on a via)
3.3V  (via drill 0.25)
  Top 0.254: U401.VCC+ C410.1 | U401.VCC+ 25.15,13.8 C409.1 | U101.3 10.88,18.57 v10.6,18.3 10.6,17.9 11,17.5 12.51,17.5 C106.2 | U301.VCC+ C309.1 9.5,27.88 C308.2 8.95,27.85 v8.5,28.3 8.15,28.65 U301.VCC+ | U100.1 25.35,17.75 v25.7,17.4 C103.2 | 16.9,23.75 U100.17 17.8,23.7 v17.9,23.8 | R207.2 v4.39,16.29 v4.4,16.3 | C310.2 15,25.69 v15,25.1 v14.4,25.1 | R315.1 16.08,29.1 16.08,29.02 v16.2,28.9 | v24.3,21.3 U100.5 | U301.VCC+ 8.15,29.85 v8.2,29.9 | R409.1 25.1,6.7 24.86,6.94 v24.86,7.16 | U401.VCC+ 25.65,13.75 v26.1,14.2 | v7.1,24.9 7.76,24.9 8.2,25.34 R308.2 | v29.12,13.71 R413.2 | 2.17,10.97 3.3V.TP | R401.2 19.2,13.9 v18.8,14.3 | R301.2 v14.1,21.5
  Top 0.406: v2,15.6 2.15,15.15 R205.2 | C101.2 16.9,24.5 16.9,23.75
  Top 0.508: R413.2
  Top 0.61: U200.7-8 2.17,10.97
  Bottom 0.254: U302.12 14.4,24.18 | 14.4,24.18 v14.4,25.1 | v15,25.1 U302.11 14.95,24.18 14.4,24.18 | C102.2 v24.31,21.29 v24.3,21.3
  other vias: 1.4,15.6 1.4,16.2 2,16.2 1.2,9.4 2,9.4 1.6,8.9 1.2,8.4 2,8.4
  pour Route15 (rank 6): 0,0 0,35 38,35 38,0
  pour Top (no thermals): 1.2,11.1 1.2,10 0.9,9.7 0.9,8.2 1.1,8 2.1,8 2.3,8.2 2.3,9.7 2.5,9.9 2.5,11.1
  pour Bottom (no thermals): 1.3,15.1 1.3,10.4 0.9,10 0.9,8.2 1.1,8 2.1,8 2.3,8.2 2.3,16.3 2.1,16.5 1.3,16.5 1.1,16.3 1.1,15.3
250_REF
  Top 0.254: C407.2 R410.1 R409.2 26.5,7.2 26.3,7.4 25.42,7.4 25.06,7.75 23.99,7.75 22.74,9 22.74,10.26 22.23,10.77 U400.11
250_TOFF
  Top 0.254: R408.1 R407.1 27.45,7.15 26.8,7.8 25.56,7.8 25.22,8.13 24.14,8.13 23.2,9.08 23.2,10.4 22.33,11.27 U400.12
AS5047_MOSI  (via drill 0.25)
  Top 0.254: R315.2 15.08,28.98 v15,28.9
  Bottom 0.254: U302.4 v15,28.9
BLDC-I-IN+
  Top 0.254: R308.1 R309.2 6.25,25.95 U301.IN+ 6.15,27 C306.1
BLDC-I-IN-
  Top 0.254: R312.1 R313.2 | R313.2 6.25,29.75 U301.IN- | R313.2 C307.1
BLDC-I-OUT
  Top 0.254: C307.2 R313.1 7.1,28.7 8.15,27.65 U301.OUT R314.2
BOOT  (via drill 0.25)
  Top 0.254: U100.31 v23.1,17.7
  Bottom 0.254: v23.1,17.7 23.1,18.38 BOOT.TP 23.2,19.18 R101.2
CAN_H
  Top 0.254: JP102.1 14.45,7.52 13.31,7.52 11.53,9.31 U101.7
CAN_L
  Top 0.254: U101.6 10.88,8.55 JP102.2
CAN_RX
  Top 0.254: U100.21 16.07,20.5 15.67,20.1 10.35,20.1 10.2,19.95 10.2,19.27 U101.4
CAN_SHDN
  Top 0.152: U101.5 10.22,17.57 10,17.8 TP1.TP
CAN_TX
  Top 0.254: U100.22 13.1,19.7 12.7,19.3 U101.1
CRYSTALIN
  Top 0.254: U100.2 28,18.9 28.32,18.57 X101.1 28.2,17.85 C105.1
CRYSTALOUT
  Top 0.254: U100.3 25.43,19.62 X101.3 27.2,19.75 C104.1 27.07,20.88
GND  (via drill 0.25, 2.2)
  Top 0.254: R408.2 C406.1 | C407.1 R410.2 | 20.15,10.77 U400.EPAD 20.65,10.27 | C408.2 28.4,9.3 R415.2 | C409.2 23.5,13.9 23.5,14.4 | 23.5,14.4 23.5,15 C410.2 23.6,15.7 23.9,16 U100.32 | U200.4 4.05,12.05 v4.3,11.8 4.4,11.7 4.8,11.7 U200.10 | U101.2 11.53,18.57 v11.8,18.3 12.6,18.3 12.8,18.5 C106.1 | R312.2 C306.2 | X101.2 28.2,19.75 C104.2 | X101.4 27.2,17.85 C105.2 | U100.32 v23.9,17.7 | U100.32 23.95,16.7 24.05,16.6 C103.1 | C101.1 v17.53,25.6 17.98,25.15 U100.16 | v13.7,25.1 13.85,25.25 C310.1 | U300.7 9.15,22.85 arc90 v9.4,23.1 | v19.8,11.1 arc-90 19.65,11.25 U400.16 19.65,12.65 C404.1 | U400.15 20.15,11.35 arc90 v20.4,11.1 | U400.7 20.65,9.65 arc90 v20.4,9.9 | C405.1 22.8,14.2 23,14.4 23.5,14.4 | R203.1 9.9,12 9.7,11.8 9.3,11.8 C203.2 9.3,10.2 | 9.3,10.2 9.3,10 | 9.3,10 9.3,9.7 9.7,9.3 C202.2 | 9.3,10 9.6,10 v10.2,10.6 9.8,10.2 9.3,10.2
  Top 0.406: C204.2 R206.1
  Top 0.508: C202.2 C201.2 10.6,7.2 v10.9,7.5
  Bottom 0.254: v13.7,25.1 U302.13 | U302.5 15.65,28.95 v15.6,28.9 | C102.1 v24.3,22.3
  other vias: 21,4.4 22.5,4.4 24,4.4 25.4,3.9 26.5,3.9 27.5,3.9 28.6,3.9 3.6,15.6 3.6,16.2 3,16.2 3,15.6 4.5,9.6 5.1,9.6 5.1,9 4.5,9 4.5,8.4 5.1,8.4 4.8,6.4 4.8,4.4 6.8,10.2 2.6,9.3 2.6,8.6 6.9,9.4 6.9,8.7 6,27.9 7.1,27.9 12.1,29.5 12.1,28.8 11.3,27.9 26.4,11.6 26.4,12.5 22.55,13.5 3.4,24.4 3.4,22.9 3.4,21.4 9.4,19.5 11.62,8.5 28.2,21.7 28.9,20.9 29.23,19.6 26.5,17.2 26.5,16.6 20.4,10.5 21,11.1 21,10.5 21,9.9 19.8,9.9 19.8,10.5 10,23.1 9.4,22.5 10,22.5 10.6,22.5 10.6,23.1 10.6,23.7 10,23.7 9.4,23.7 21.93,27.4 22.4,21.1 19.9,21.1 20.7,19.4 18.1,20.3 21.6,23.8 24.23,27.4 10,2.1 20,2.1 20,32 10,32 9.4,18.6 12.6,15.7 13.4,15.7 18,15.3 22.55,12.7 23.5,11 22.5,2.5 26.4,21.2 23.5,22 19.9,21.9 20.7,21.9 21.5,21.9 20.7,21.1 20.7,20.3 19.9,20.3 20.7,18.4 22.2,18.4 22.2,19.8 19,19.4 16.7,17.4 15.8,18.9 14,19.1 18,22 20.7,23.8 21.6,29.9 20,29.9 18.6,30.2 21.6,30.7 21.8,33.1 21.8,34.1 20,34.1 18.2,34.1 18.2,33.1 11.6,29.9 10,29.9 11.6,30.7 8.4,30.6 8.3,33.3 8.3,34.3 10,34.3 11.7,34.3 11.7,33.3 10.2,26.8 11.3,26.8 10,25.4 10.1,15.6 9.5,16.6 17.1,16.1 14.7,14.4 16.5,14.4 14.1,11.5 12.4,11.6 10.3,13.2 10.9,6.6 11.8,6.6 11.8,3.7 8.5,3.7 12.52,7.6 12.42,9.9 12.52,4 15.02,4 17.62,3.9 17.62,6.8 17.72,11.7 1.52,6.1 1.52,3.6 2.5,2.5 5,2.5 7.5,2.5 2.5,17.5 3.1,20.1 2.5,22.5 2.5,25 2.5,30 2.5,32.5 5,32.5 7.5,32.5 12.5,32.5 15,32.5 17.5,32.5 22.5,32.5 22.5,30 25,30 25,32.5 27.5,32.5 27.5,30 27.5,27.5 27.5,22.5 27.5,2.5 25,2.5 32.5,2.5 35,2.5 35,5 32.5,5 32.5,12.5 32.5,17.5 35,17.5 35,20 32.5,20 32.5,22.5 32.5,25 35,25 35,27.5 35,30 35,32.5 35.4,12.5 26.1,25.5 21.7,11.9 22.55,11.9 27.8,8 28.8,8 29.3,7.4 28.3,7.4 23,7.7 23.9,9.9 21.7,12.7 21.7,13.5 14.1,22.4
  pour Route2 (rank 6): 0,0 0,35 38,35 38,0
  pour Top (rank 6): 0,0 0,35 38,35 38,0
  pour Bottom (rank 6): 0,0 0,35 38,35 38,0
  pour Bottom (no thermals): 2.7,16.3 2.7,15.3 3,15 3,10.2 3.4,9.8 4,9.8 4.2,9.5 4.2,8.2 4.3,8.1 5.2,8.1 5.4,8.3 5.4,10.1 4.5,11 4.5,12.4 4.2,12.7 4.2,13.7 3.7,14.2 3.7,15.1 3.9,15.3 3.9,16.3 3.7,16.5 2.9,16.5
MAG-I-IN+
  Top 0.254: R414.2 U401.IN+ 27.45,11.8 C408.1 R413.1
MAG-I-IN-
  Top 0.254: R418.2 C411.1 | C411.1 R417.1 | C411.1 24.35,11.85 U401.IN-
MAG-I-OUT
  Top 0.254: R419.2 U401.OUT 26.75,13.75 25.8,12.8 C411.2 R418.1
N$2
  Top 0.254: R407.2 C406.2
N$3
  Top 0.254: U400.2 18.63,10.77 18.44,10.96 18.44,13.32 16.36,15.4 14.8,15.4 14.5,15.7 R406.1
N$5
  Top 0.254: U400.1 19.01,13.29 16.2,16.1 R405.1
N$7
  Top 0.254: U300.6 7.65,23.35 7.2,22.9 C301.1
  Top 0.508: C302.1 C301.1 C303.1
  Top 0.61: R303.1 C303.1
N$8
  Top 0.254: 20.2,6.9 20.15,6.95 U400.6
  Top 0.508: C403.1 C402.1 C401.1 20.2,6.9 R403.1
NRESET  (via drill 0.25)
  Top 0.254: U100.4 v24.3,20.5
  Bottom 0.254: v24.3,20.5 24.3,19.94 24.55,19.68 24.55,17.75 26.3,16 33.72,16 36.4,13.32 36.4,6.2 34.58,6.2 J1.!RESET
OUT1  (via drill 0.25)
  Top 0.254: U400.3 16.87,10.27 16.27,9.67 JP401.1 | U400.10 22.11,10.27 22.36,10.03 22.36,8.86 v22.36,8.3
  Bottom 0.254: v22.36,8.3 22.28,8.3 21.77,7.79 17.78,7.79 JP401.1
OUT2  (via drill 0.25)
  Top 0.254: U400.5 19.65,8.55 19.4,8.3 v18.3,8.3 | U400.8 21.15,8.75 v21.6,8.3
  Bottom 0.254: v21.6,8.3 v18.3,8.3
  Bottom 0.508: JP401.2 13.89,9.3 15.8,11.21 16.74,11.21 17.41,10.54 17.41,9.19 v18.3,8.3
PA0/CURR_FDB_MAG  (via drill 0.25)
  Top 0.254: R419.1 28.4,15.6 28.9,16.1 v28.9,16.7 | v26.6,22.1 U100.6
  Bottom 0.254: v28.9,16.7 28.9,19.22 28.74,19.37 28.74,20.16 26.86,22.04 26.66,22.04 v26.6,22.1
PA1/CURR_FDB_BLDC
  Top 0.254: R314.1 11.5,25.9 13.64,28.05 15.65,28.05 15.7,28.1 24.5,28.1 27.1,25.5 27.1,23.7 26.3,22.9 U100.7
PA2/USART2_TX  (via drill 0.25)
  Top 0.254: U100.8 v26.4,23.7
  Bottom 0.254: JP103.P$2 36.3,21.45 34.2,23.55 28.5,23.55 28.35,23.7 v26.4,23.7
PA3/USART2_RX  (via drill 0.25)
  Top 0.254: U100.9 24.55,25.15 v24.6,25.2
  Bottom 0.254: v24.6,25.2 25.4,24.4 28.19,24.4 28.66,23.93 JP103.P$3
PA4/FAULT_BLDC  (via drill 0.25)
  Top 0.254: v20.4,22.9 22.1,22.9 23.1,23.9 U100.10 C305.2 R302.1 | U300.13 11.36,21.9 v11.42,21.84
  Bottom 0.254: v20.4,22.9 13,22.9 11.94,21.84 v11.42,21.84
PA5/SPI1_SCK  (via drill 0.25)
  Top 0.254: v13.84,27.57 20.64,27.57 22.3,25.9 U100.11
  Bottom 0.254: U302.2 13.7,27.71 v13.84,27.57
PA6/SPI1_NSS  (via drill 0.25)
  Top 0.254: v13.5,27.08 20.32,27.08 21.5,25.9 U100.12
  Bottom 0.254: U302.1 13.05,27.53 v13.5,27.08
PA7/INUL  (via drill 0.25)
  Top 0.254: U300.1 v11.89,24.49 v11.9,24.5 | U100.13 20.7,26 20.1,26.6 18,26.6 13.5,26.6 v12.7,25.8
  Bottom 0.254: v11.9,24.5 12.6,25.2 12.6,25.7 v12.7,25.8
PA8/INUH/PWM_MAG  (via drill 0.25)
  Top 0.254: U300.2 10.22,24.92 10.5,25.2 12.8,25.2 15.1,22.9 16,22.9 | 16,22.9 U100.18 | R406.2 v14.5,17.8 | v15.2,22.42 15.52,22.42 16,22.9
  Bottom 0.254: v15.2,22.42 15.06,22.28 14.9,22.28 14.62,22 14.62,17.92 v14.5,17.8
PA9/INVH/DIR_MAG  (via drill 0.25)
  Top 0.254: U300.16 13.45,23.85 14.6,22.7 14.6,22.3 v15.1,21.8 15.8,21.8 16.1,22.1 U100.19 | R405.2 v15.5,17.8
  Bottom 0.254: v15.5,17.8 15.5,17.93 15.1,18.34 v15.1,21.8
PA10/INWH
  Top 0.254: U100.20 14.58,21.3 14.18,20.9 10.9,20.9 10.72,21.08 U300.12
PA15/CAN_SILENT  (via drill 0.25)
  Top 0.254: U101.8 v12.8,16.7 | v17.5,16.7 17.55,16.65 U100.25
  Bottom 0.254: v12.8,16.7 v17.5,16.7
PB0/INVL  (via drill 0.25)
  Top 0.254: U300.15 12.45,23.35 v12.5,23.3 | v19.58,23.6 19.9,23.92 U100.14
  Bottom 0.254: v12.5,23.3 19.28,23.3 v19.58,23.6
PB1/INWL  (via drill 0.25)
  Top 0.254: v18.2,21.2 19.1,22.1 U100.15 | U300.11 10.22,20.98 10.69,20.52 15.3,20.52 v15.6,20.82
  Bottom 0.254: v15.6,20.82 17.82,20.82 v18.2,21.2
PB3/EN_MAG
  Top 0.254: R402.2 19.1,15.3 U100.26
PB4/SPI1_MISO  (via drill 0.25)
  Top 0.254: v18.6,23.9 v18.6,22.4 | v19,20.3 19.9,19.4 U100.27
  Bottom 0.254: U302.3 14.35,28.05 14.7,27.7 14.7,26.2 16.07,24.83 17.73,24.83 18.66,23.9 v18.6,23.9 | v18.6,22.4 18.6,22.1 19,21.7 v19,20.3
PB6/EN_BLDC
  Top 0.254: R302.2 25.1,24.7 21.5,21.1 U100.29
PB7/FAULT_MAG
  Top 0.254: U100.30 C405.2 21.2,15.2 | 21.15,12.1 U400.13 21.15,12.3 21.2,12.35 21.2,15.2 | 21.15,15.2 R402.1 21.2,15.2
QUAD_A
  Bottom 0.254: U302.7 17.32,29.88 18.41,28.79 JP302.1
QUAD_B
  Bottom 0.254: U302.6 16.3,30.7 16.7,31.1 17.2,31.1 17.6,30.7 17.6,30.3 18.73,29.17 30.67,29.17 32.5,31 JP302.2
SENSE_BLDC  (via drill 0.25)
  Top 0.254: U300.9 v8.61,21.71 v8.6,21.7 | v8.6,24.5 U300.4 | R309.1 3.9,25.9 R311.2
  Bottom 0.254: v8.6,21.7 v8.6,24.5
  Bottom 0.508: v8.6,24.5 6.9,26.2 v1.9,26.2
  other vias: 2.5,26.6 2.5,25.8
  pour Top (no thermals): 4.2,26.7 2.9,26.7 2.7,26.9 2.1,26.9 1.6,26.4 1.6,26 2.1,25.5 2.7,25.5 2.9,25.7 4.2,25.7
  pour Bottom (no thermals): 4.2,26.7 2.9,26.7 2.7,26.9 2.1,26.9 1.6,26.4 1.6,26 2.1,25.5 2.7,25.5 2.9,25.7 4.2,25.7
SENSE_MAG  (via drill 0.25)
  Top 0.254: U400.4 arc90 U400.4 v19,9.2 | U400.9 arc-90 U400.9 v21.8,9.2 | R414.1 26.5,10.6 R415.1
  Bottom 0.254: v19,9.2 v21.8,9.2
  Bottom 0.508: v21.8,9.2 24.7,9.2 v24.9,9
  other vias: 25.5,8.7 25.5,9.4
  pour Top (rank 5, no thermals): 27,9.8 26,9.8 25.4,9.8 25,9.4 24.8,9.4 24.7,9.4 24.5,9.2 24.5,8.8 24.7,8.6 25,8.6 25.3,8.3 25.7,8.3 26,8.6 27,8.6
  pour Bottom (rank 5, no thermals): 27,9.8 26,9.8 25.4,9.8 25,9.4 24.8,9.4 24.7,9.4 24.5,9.2 24.5,8.8 24.7,8.6 25,8.6 25.3,8.3 25.7,8.3 26,8.6 27,8.6
STBY/RESET_BLDC
  Top 0.254: U300.14 11.75,22.85 12.1,22.5 C304.2 R301.1
STBY/RESET_MAG
  Top 0.254: U400.14 20.65,12.65 C404.2 R401.1
SWCLK  (via drill 0.25)
  Top 0.254: U100.24 v17.9,18.1 | v33.4,15.1 34.3,14.2 34.9,14.2 36.4,12.7 36.4,10.4 36,10 34.56,10 J1.SWDCLK
  Bottom 0.254: v17.9,18.1 18.58,18.1 19.84,16.84 24.39,16.84 25.98,15.24 33.26,15.24 v33.4,15.1
SWDIO  (via drill 0.25)
  Top 0.254: U100.23 v17.9,18.9
  Bottom 0.254: v17.9,18.9 18.32,18.9 20,17.22 24.54,17.22 26.14,15.62 33.56,15.62 34.53,14.65 J1.SWDIO
TPS-EN
  Top 0.254: U200.1 5.55,11.95 5.78,11.72 U200.14 6.83,11.72 7,11.9 R202.1 7,12.9 7.15,13.05 8.65,13.05 8.9,12.9 | 8.9,12.9 arc0 9.2,13.1 EN.TP | R203.2 8.9,12.9
TPS-FB
  Top 0.254: U200.5 3.4,13.5 R206.2 R205.1
TPS-L1
  pour Top (no thermals): 5.2,11.4 5.2,10.1 5.5,9.8 5.5,4.7 6.5,4.7 6.5,9.6 5.4,10.7 5.4,11.4
TPS-L2
  pour Top (no thermals): 4.4,11.4 4.4,10.1 4.1,9.8 4.1,4.7 3.1,4.7 3.1,9.6 4.2,10.7 4.2,11.4
TPS-PG
  Top 0.254: U200.2 5.05,13.75 5.45,14.15 | R207.1 5.39,14.21 5.45,14.15 | PG.TP 5.65,14.15 5.45,14.15
TPS-VAUX
  Top 0.254: U200.3 4.55,12.99 4.3,13.24 C204.1
TPS-VIN
  Top 0.254: R202.2 7.9,12.35 7.9,11.9 7.67,11.68 7.67,11.03
  Top 0.508: U200.12-13 7.67,11.03 C203.1 7.7,9.4 C202.1 C201.1 R201.1
TSP-FB2
  Top 0.254: U200.6 2.27,11.72 FB2.TP
TSP-VSEL
  Top 0.254: U200.15 6.2,12.7 7.5,14 VSEL.TP 7.4,14.3 8,14.9 8,15.44 R204.2
U  (via drill 0.25)
  Top 0.254: U300.3 9.72,24.98 9.64,25.06 8.46,25.06 v7.8,24.4
  Bottom 0.254: JP301.1 13,13.7 12.5,14.2 9.2,14.2 8.2,15.2 8.2,16.4 7.3,17.3 7.3,23.9 v7.8,24.4
V  (via drill 0.25)
  Top 0.254: U300.8 8.05,22.35 7.9,22.2 v7.9,21
  Bottom 0.254: v7.9,21 7.9,17.24 8.58,16.56 8.58,15.36 9.32,14.62 13.28,14.62 JP301.2
V_BATT  (via drill 0.25)
  Top 0.254: 10.1,4.6 9.7,5 9.3,4.6 | 9.7,5.4 9.3,5.8 | R201.2 9.7,5.4 | 9.7,5.4 10.1,5.8
  other vias: 18.1,5.5 18.7,4.1 18.1,4.7 6.4,16.3 10.9,5.6 10.9,4.8 11.4,5.2 11.9,5.6 11.9,4.8 7.1,15.6 6.4,15.6 7.1,16.3
  pour Route15 (rank 5, no thermals): 38,27.6 35.8,27.6 35.2,27 35.2,5.8 34.6,5.2 31.4,5.2 30.9,5.7 18.4,5.7 7.3,16.8 6.3,16.8 6,16.5 6,15.4 8.5,12.9 8.5,0 38,0
  pour Top (no thermals): 19.8,5.7 18.5,5.7 18.4,5.8 18.3,5.9 17.9,5.9 17.7,5.7 17.7,4.6 17.7,4.5 18.5,3.7 18.9,3.7 19,3.8 19.1,3.9 19.1,4.2 19.5,4.6 19.8,4.6
  pour Top (no thermals): 9.3,5.8 10.6,5.8 10.7,5.9 10.8,6 12.1,6 12.3,5.8 12.3,4.6 12.2,4.5 12.1,4.4 10.7,4.4 10.5,4.6 9.3,4.6
  pour Top (no thermals): 5.4,18.5 5.4,16.7 6,16.1 6,15.4 6.2,15.2 7.3,15.2 7.5,15.4 7.5,16.5 6.6,17.4 6.6,18.5
W  (via drill 0.25)
  Top 0.254: U300.10 9.72,21.12 9.3,20.7 8.8,20.7 v8.4,20.3
  Bottom 0.254: v8.4,20.3 8.4,17.28 8.96,16.72 8.96,15.52 9.48,15 14.93,15 17.03,12.9 JP301.3

### Text on the board
tPlace: OreSat / ACS | Rev 3